# EasyEDA schematic SCH_sensoresAgua_2026-07-03.json
TITLE: Sheet_1; REV: 1.0; Date: 2023-09-17; Sheet: 1/1; Drawn By: glaicon.florisbelo; Company: UFU
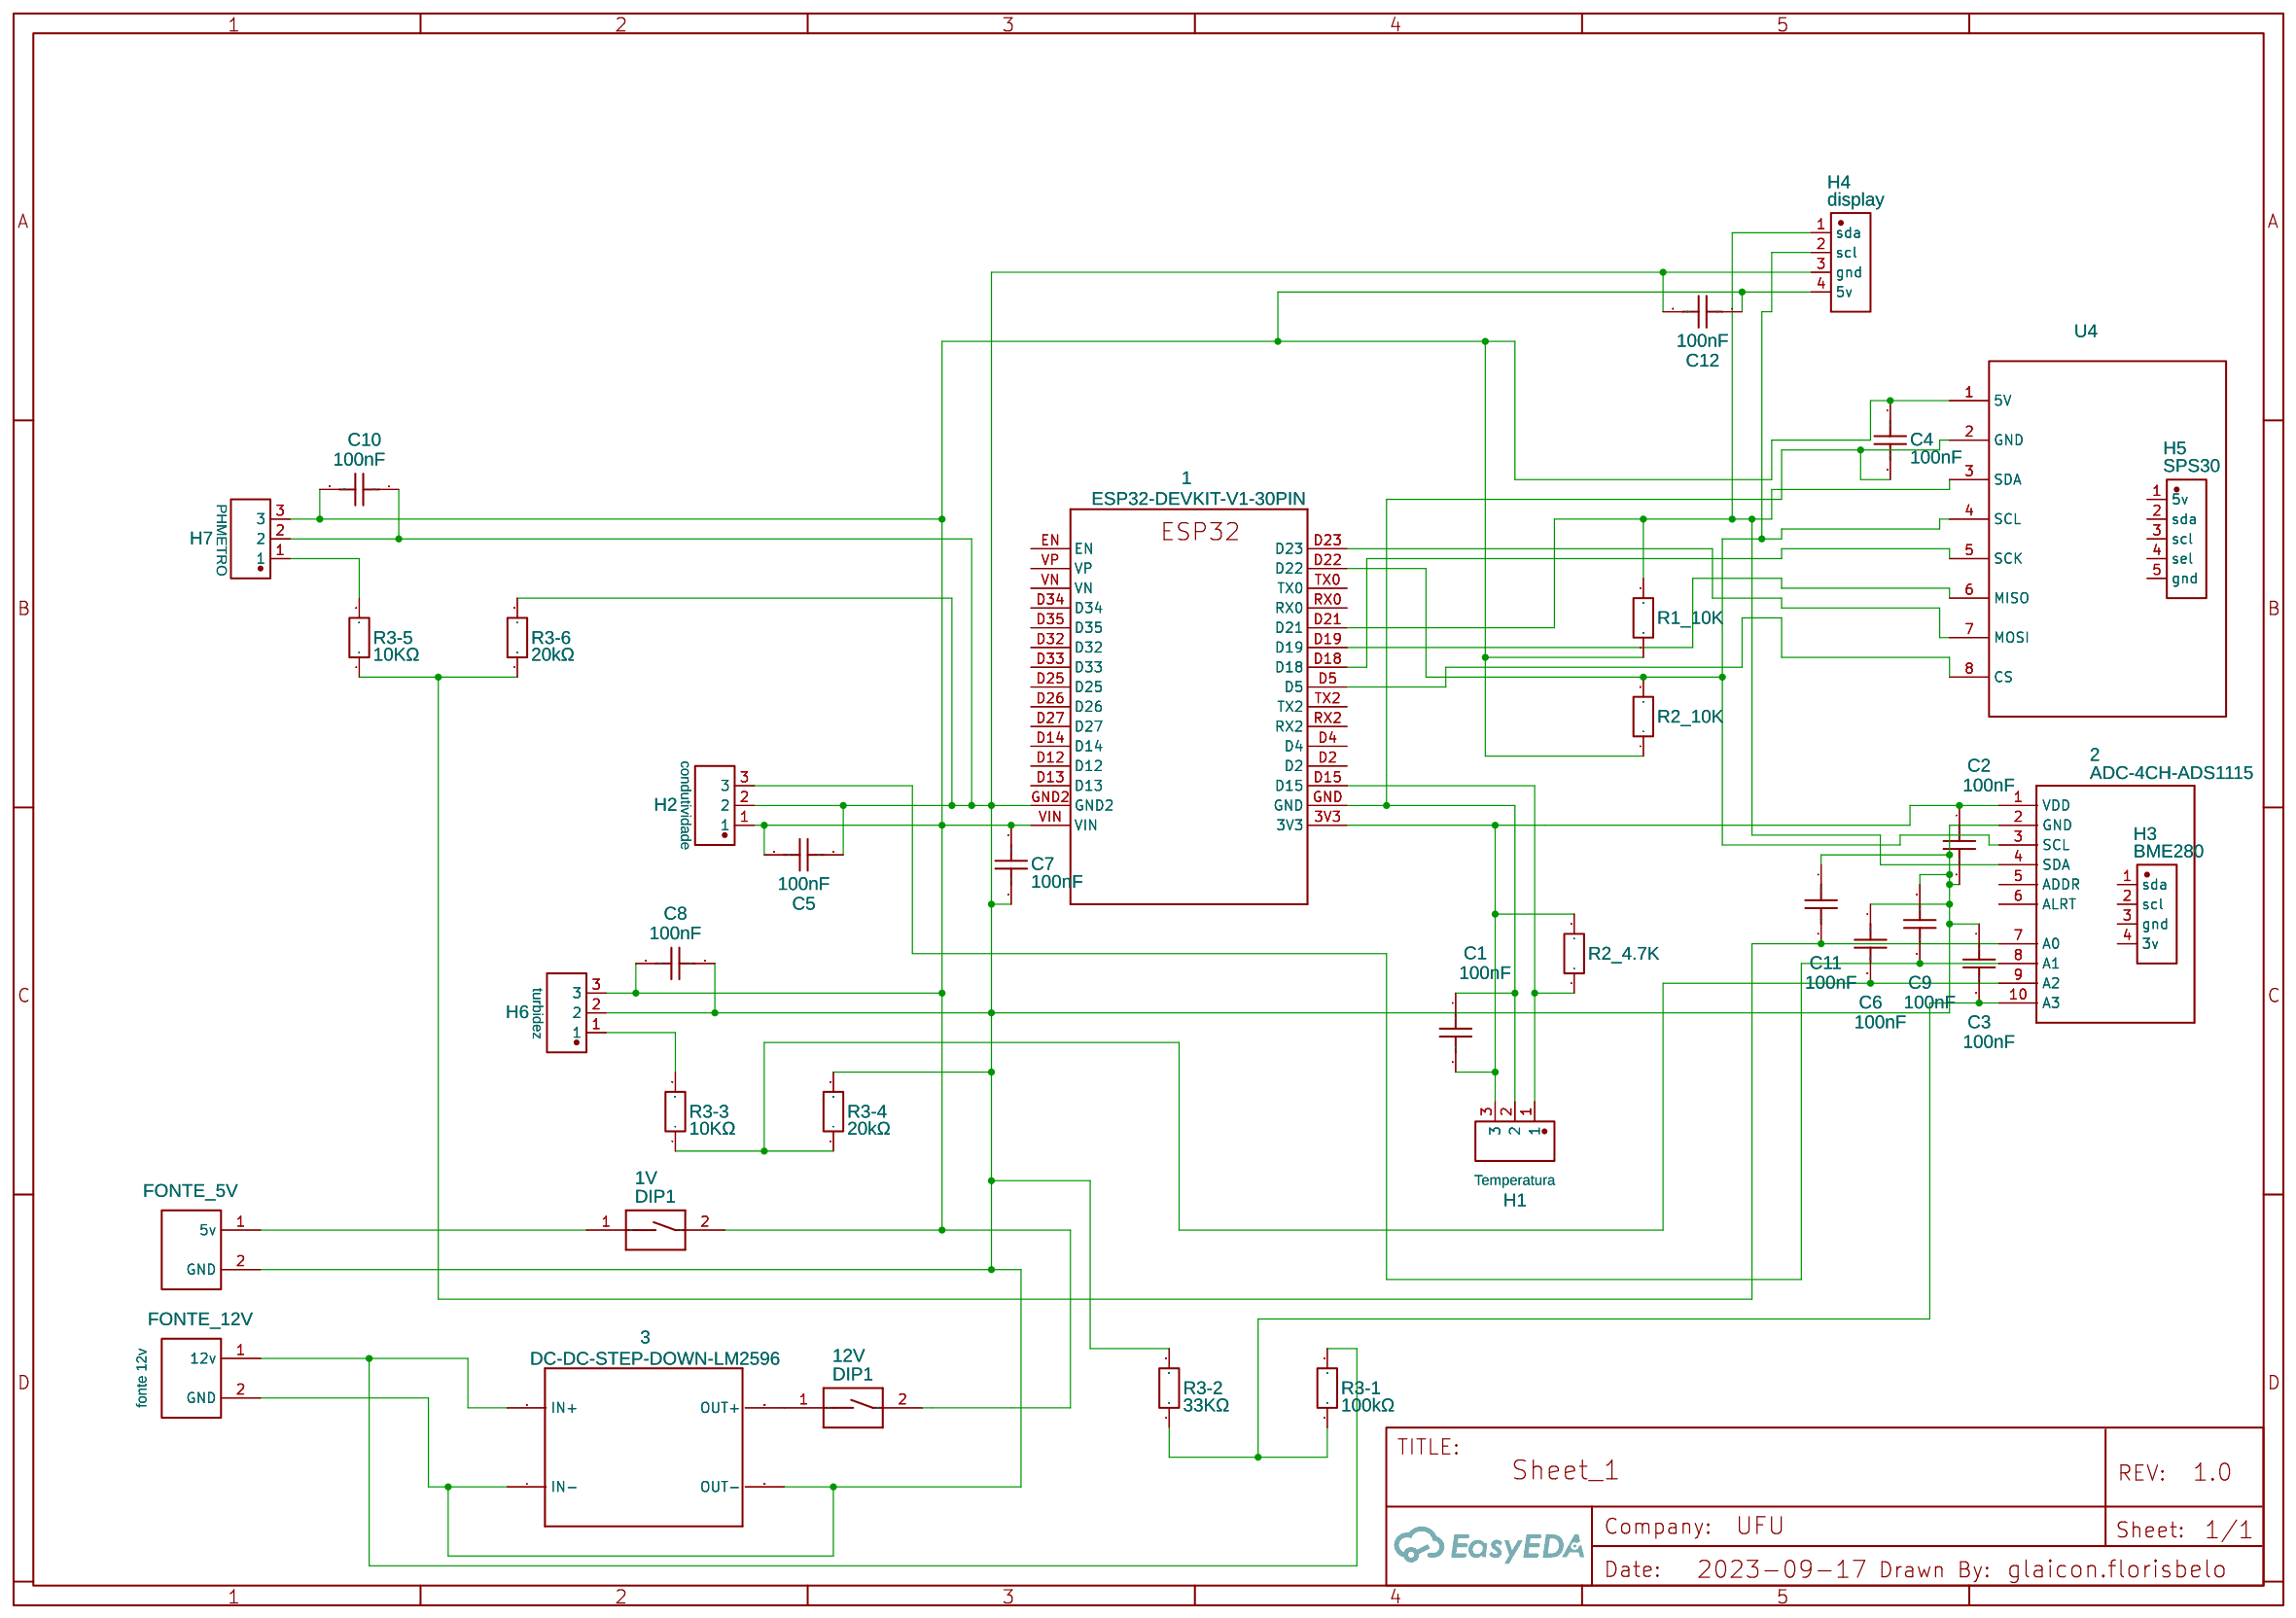
[diagram p0: schematic sheet]

## Parts
1  ESP32-DEVKIT-V1-30PIN  [ESP32-DEVKITV1_ESP32-DEVKITV1]
1V  DIP1  [DIP SWITCH DIP1]
2  ADC-4CH-ADS1115  [ADC-4CH-ADS1115]
3  DC-DC-STEP-DOWN-LM2596  [DC-DC-STEP-DOWN-LM2596]
12V  DIP1  [DIP SWITCH DIP1]
C1  100nF  [CAP-TH_L5.0-W2.5-P5.00-D1.0]
C2  100nF  [CAP-TH_L5.0-W2.5-P5.00-D1.0]
C3  100nF  [CAP-TH_L5.0-W2.5-P5.00-D1.0]
C4  100nF  [CAP-TH_L5.0-W2.5-P5.00-D1.0]
C5  100nF  [CAP-TH_L5.0-W2.5-P5.00-D1.0]
C6  100nF  [CAP-TH_L5.0-W2.5-P5.00-D1.0]
C7  100nF  [CAP-TH_L5.0-W2.5-P5.00-D1.0]
C8  100nF  [CAP-TH_L5.0-W2.5-P5.00-D1.0]
C9  100nF  [CAP-TH_L5.0-W2.5-P5.00-D1.0]
C10  100nF  [CAP-TH_L5.0-W2.5-P5.00-D1.0]
C11  100nF  [CAP-TH_L5.0-W2.5-P5.00-D1.0]
C12  100nF  [CAP-TH_L5.0-W2.5-P5.00-D1.0]
FONTE_5V  CONN-TH_2P-P5.00_WJ300V-5.00-2P WJ300V-5.0-2P  [CONN-TH_2P-P5.00_WJ300V-5.00-2P]
FONTE_12V  fonte 12v  [CONN-TH_2P-P5.00_WJ300V-5.00-2P]
H1  Temperatura  [HDR-TH_3P-P2.00-V-M]
H2  condutividade  [HDR-TH_3P-P2.00-V-M]
H3  BME280  [HDR-TH_4P-P2.54-V-F]
H4  display  [HDR-TH_4P-P2.54-V-F]
H5  SPS30  [HDR-TH_5P-P2.54-V-F]
H6  turbidez  [HDR-TH_3P-P2.00-V-M]
H7  PHMETRO  [HDR-TH_3P-P2.00-V-M]
R1_10K  100kΩ  [RES-TH_BD2.7-L6.2-P10.20-D0.4]
R2_4.7K  100kΩ  [RES-TH_BD2.7-L6.2-P10.20-D0.4]
R2_10K  100kΩ  [RES-TH_BD2.7-L6.2-P10.20-D0.4]
R3-1  100kΩ  [RES-TH_BD2.7-L6.2-P10.20-D0.4]
R3-2  33KΩ  [RES-TH_BD2.7-L6.2-P10.20-D0.4]
R3-3  10KΩ  [RES-TH_BD2.7-L6.2-P10.20-D0.4]
R3-4  20kΩ  [RES-TH_BD2.7-L6.2-P10.20-D0.4]
R3-5  10KΩ  [RES-TH_BD2.7-L6.2-P10.20-D0.4]
R3-6  20kΩ  [RES-TH_BD2.7-L6.2-P10.20-D0.4]
U4  NO  [DATALOGGER DEEK-ROBOT]

## Library data of the parts
1 = ESP32-DEVKIT-V1-30PIN: Contributor: KiraKira san
1V 12V = DIP1: Supplier: Digi-Key; Manufacturer: Omron Electronics Inc-EMC Div; Manufacturer Part: A6TN-1101; Supplier Part: Z12167-ND
2 = ADC-4CH-ADS1115: Contributor: David de la Torre
3 = DC-DC-STEP-DOWN-LM2596: Contributor: rowenaminong
C1-C12 = CC1H104MC1FD3F6C10MF: Contributor: LCSC; Supplier: LCSC; Supplier Part: C254085; Manufacturer: Dersonic(德尔创); JLCPCB Part Class: Extended Part
FONTE_5V FONTE_12V = WJ300V-5.0-2P: Supplier: LCSC; Manufacturer: KANGNEX(康奈克斯电气); Supplier Part: C8385; JLCPCB Part Class: Extended Part
H1 H2 H6 H7 = X4611WV-03I-C28D40: Supplier: LCSC; Supplier Part: C706996; Manufacturer: XKB Connectivity(中国星坤); Contributor: LCSC; JLCPCB Part Class: Extended Part
H3 H4 = MTF185-104SY1: Contributor: LCSC; Supplier: LCSC; Supplier Part: C358718; Manufacturer: MINTRON(明硕); JLCPCB Part Class: Extended Part; link: https://lcsc.com/eda_search?q=C358718&%26type=1&ref=editor
H5 = MTF185-105SY1: Contributor: LCSC; Supplier: LCSC; Supplier Part: C358719; Manufacturer: MINTRON(明硕); JLCPCB Part Class: Extended Part; link: https://lcsc.com/eda_search?q=C358719&%26type=1&ref=editor
R1_10K R2_4.7K R2_10K = CR1/4W-100K±5%-ST26: Contributor: lcsc; Supplier: LCSC; Supplier Part: C2894598; Manufacturer: VO(翔胜); JLCPCB Part Class: Extended Part; link: https://lcsc.com/eda_search?q=C2894598&%26type=1&ref=editor
R3-1-R3-6 = CR1/4W-330Ω±5%-ST26: Supplier: LCSC; Supplier Part: C2894631; Manufacturer: VO(翔胜); link: https://atta.szlcsc.com/upload/public/pdf/source/20210803/C2857407_45FF53FE186CAB545115AD37303966CD.pdf; Contributor: lcsc; JLCPCB Part Class: Extended Part
U4 = DATALOGGER-DFROBOT: Contributor: schontz0310

## Nets
Net-(1-3V3): 1.3V3 2.1(VDD) C1.2 C2.1 H1.3 R2_4.7K.2
Net-(1-D5): 1.D5 U4.8(CS)
Net-(1-D15): 1.D15 H1.1 R2_4.7K.1
Net-(1-D18): 1.D18 U4.5(SCK)
Net-(1-D19): 1.D19 U4.6(MISO)
Net-(1-D21): 1.D21 2.4(SDA) H4.1(sda) R1_10K.1 U4.3(SDA)
Net-(1-D22): 1.D22 2.3(SCL) H4.2(scl) R2_10K.2 U4.4(SCL)
Net-(1-D23): 1.D23 U4.7(MOSI)
Net-(1-GND2): 1.GND2 2.2(GND) 3.IN- 3.OUT- C2.2 C3.1 C5.1 C6.1 C7.2 C8.1 C9.1 C10.1 C11.1 C12.2 FONTE_5V.2(GND) FONTE_12V.2(GND) H2.2 H4.3(gnd) H6.2 H7.2 R3-2.2 R3-4.2 R3-6.2
Net-(1-GND): 1.GND C1.1 C4.2 H1.2 U4.2(GND)
Net-(1-VIN): 1.VIN 1V.2 12V.2 C4.1 C5.2 C7.1 C8.2 C10.2 C12.1 H2.1 H4.4(5v) H6.3 H7.3 R1_10K.2 R2_10K.1 U4.1(5V)
Net-(1V-1): 1V.1 FONTE_5V.1(5v)
Net-(2-7): 2.7(A0) C11.2 R3-5.1 R3-6.1
Net-(2-8): 2.8(A1) C9.2 H2.3
Net-(2-9): 2.9(A2) C6.2 R3-3.1 R3-4.1
Net-(2-10): 2.10(A3) C3.2 R3-1.1 R3-2.1
Net-(3-IN+): 3.IN+ FONTE_12V.1(12v) R3-1.2
Net-(3-OUT+): 3.OUT+ 12V.1
Net-(H6-1): H6.1 R3-3.2
Net-(H7-1): H7.1 R3-5.2

Not connected (* = marked no-connect by the designer): 1 D2 D4 D12 D13 D14 D25 D26 D27 D32 D33 D34 D35 EN RX0 RX2 TX0 TX2 VN VP; 2 5(ADDR) 6(ALRT); H3 1(sda) 2(scl) 3(gnd) 4(3v); H5 1(5v) 2(sda) 3(scl) 4(sel) 5(gnd)
